# Altium schematic sheet M48_CORE.SchDoc
size A4
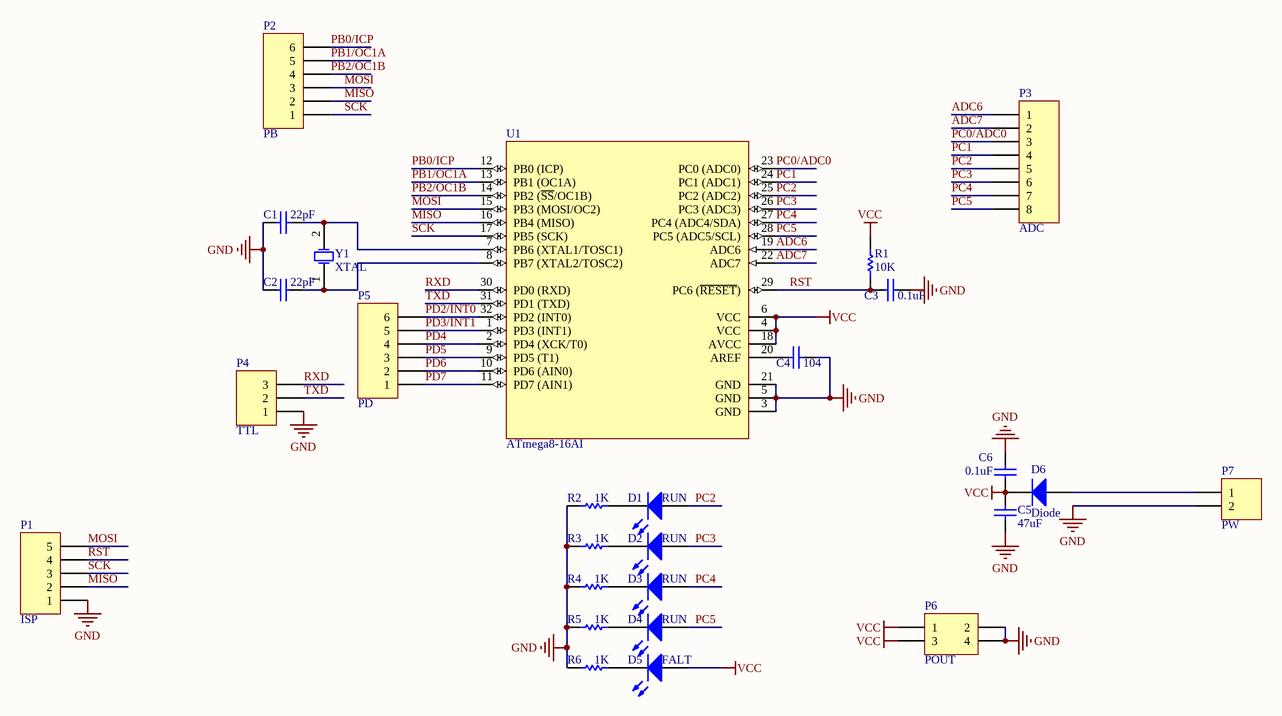
[diagram p0: M48_CORE.SchDoc]

## Parts
C1  value 22pF  [0603]  (hidden comment: Cap)
C2  value 22pF  [0603]  (hidden comment: Cap)
C3  value 0.1uF  [0603]  (hidden comment: Cap)
C4  value 104  [0603]  (hidden comment: Cap)
C5  value 47uF  [3216[1206]]  (hidden comment: Cap)
C6  value 0.1uF  [0603]  (hidden comment: Cap)
D1  RUN  [0603-LED]
D2  RUN  [0603-LED]
D3  RUN  [0603-LED]
D4  RUN  [0603-LED]
D5  FALT  [0603-LED]
D6  Diode  [SMA]
P1  ISP  [HDR1X5]
P2  PB  [HDR1X6]
P3  ADC  [HDR1X8]
P4  TTL  [HDR1X3]
P5  PD  [HDR1X6]
P6  POUT  [HDR2X2]
P7  PW  [XH2.54-2P]
R1  value 10K  [0603]  (hidden comment: Res1)
R2  value 1K  [0603]  (hidden comment: Res1)
R3  value 1K  [0603]  (hidden comment: Res1)
R4  value 1K  [0603]  (hidden comment: Res1)
R5  value 1K  [0603]  (hidden comment: Res1)
R6  value 1K  [0603]  (hidden comment: Res1)
U1  ATmega8-16AI  [32A_N]
Y1  XTAL  [XT5032]

## Nets
GND: C1.2 C2.2 C3.2 C4.2 C5.1 C6.1 P1.1 P4.1 P6.2 P6.4 P7.2 R2.2 R3.2 R4.2 R5.2 R6.2 U1.3(GND) U1.5(GND) U1.21(GND)
VCC: C5.2 C6.2 D5.1(A) D6.2(K) P6.1 P6.3 R1.2 U1.4(VCC) U1.6(VCC) U1.18(AVCC)
ADC6: P3.1 U1.19(ADC6)
ADC7: P3.2 U1.22(ADC7)
MISO: P1.2 P2.2 U1.16(PB4_(MISO))
MOSI: P1.5 P2.3 U1.15(PB3_(MOSI/OC2))
PB0/ICP: P2.6 U1.12(PB0_(ICP))
PB1/OC1A: P2.5 U1.13(PB1_(OC1A))
PB2/OC1B: P2.4 U1.14(PB2_(~{SS}/OC1B))
PC0/ADC0: P3.3 U1.23(PC0_(ADC0))
PC1: P3.4 U1.24(PC1_(ADC1))
PC2: D1.1(A) P3.5 U1.25(PC2_(ADC2))
PC3: D2.1(A) P3.6 U1.26(PC3_(ADC3))
PC4: D3.1(A) P3.7 U1.27(PC4_(ADC4/SDA))
PC5: D4.1(A) P3.8 U1.28(PC5_(ADC5/SCL))
PD2/INT0: P5.6 U1.32(PD2_(INT0))
PD3/INT1: P5.5 U1.1(PD3_(INT1))
PD4: P5.4 U1.2(PD4_(XCK/T0))
PD5: P5.3 U1.9(PD5_(T1))
PD6: P5.2 U1.10(PD6_(AIN0))
PD7: P5.1 U1.11(PD7_(AIN1))
RST: C3.1 P1.4 R1.1 U1.29(PC6_(~{RESET}))
RXD: P4.3 U1.30(PD0_(RXD))
SCK: P1.3 P2.1 U1.17(PB5_(SCK))
TXD: P4.2 U1.31(PD1_(TXD))
NetC1_1: C1.1 U1.7(PB6_(XTAL1/TOSC1)) Y1.2(OSC2)
NetC2_1: C2.1 U1.8(PB7_(XTAL2/TOSC2)) Y1.1(OSC1)
NetC4_1: C4.1 U1.20(AREF)
NetD1_2: D1.2(K) R2.1
NetD2_2: D2.2(K) R3.1
NetD3_2: D3.2(K) R4.1
NetD4_2: D4.2(K) R5.1
NetD5_2: D5.2(K) R6.1
NetD6_1: D6.1(A) P7.1

## Library data of the parts
C1-C6 = Cap: Capacitor; Published: 8-Jun-2000; LatestRevisionDate: 17-Jul-2002; LatestRevisionNote: Re-released for DXP Platform.; PackageReference: RAD-0.3; Publisher: Altium Limited
D1-D5 = LED2: Typical RED, GREEN, YELLOW, AMBER GaAs LED; Published: 8-Jun-2000; LatestRevisionDate: 17-Jul-2002; LatestRevisionNote: Re-released for DXP Platform.; PackageDocument: Feb-2002; PackageReference: 3.2X1.6X1.1; Publisher: Altium Limited
D6 = Diode: Default Diode; Published: 8-Jun-2000; LatestRevisionDate: 17-Jul-2002; LatestRevisionNote: Re-released for DXP Platform.; PackageDocument: Sep-1996; PackageReference: SMC; Publisher: Altium Limited; Code_JEDEC: DO-214-AB
P1 = Header 5: Header, 5-Pin; LatestRevisionDate: 17-Jul-2002; LatestRevisionNote: Re-released for DXP Platform.; Publisher: Altium Limited
P2 P5 = Header 6: Header, 6-Pin; LatestRevisionDate: 17-Jul-2002; LatestRevisionNote: Re-released for DXP Platform.; Publisher: Altium Limited
P3 = Header 8: Header, 8-Pin; LatestRevisionDate: 17-Jul-2002; LatestRevisionNote: Re-released for DXP Platform.; Publisher: Altium Limited
P4 = Header 3: Header, 3-Pin; LatestRevisionDate: 17-Jul-2002; LatestRevisionNote: Re-released for DXP Platform.; Publisher: Altium Limited
P6 = Header 2X2H: Header, 2-Pin, Dual row, Right Angle; LatestRevisionDate: 17-Jul-2002; LatestRevisionNote: Re-released for DXP Platform.; Publisher: Altium Limited
P7 = Header 2: Header, 2-Pin; LatestRevisionDate: 17-Jul-2002; LatestRevisionNote: Re-released for DXP Platform.; Publisher: Altium Limited
R1-R6 = Res1: Resistor; Published: 8-Jun-2000; LatestRevisionDate: 17-Jul-2002; LatestRevisionNote: Re-released for DXP Platform.; PackageReference: AXIAL-0.3; Publisher: Altium Limited
U1 = ATmega8-16AI: 8-Bit AVR Microcontroller with 8K Bytes of In-System Programmable Flash Memory; Published: 17-Sep-2003; LatestRevisionDate: 13-Apr-2006; LatestRevisionNote: IPC-7351 Footprint Added.; DatasheetVersion: 2486H-AVR-09/02; PackageVersion: revB, Oct-2001; PackageReference: 32A; Publisher: Altium Limited; PackageDescription: 32-Pin Thin Quad Flat Pack 0.8 mm Pitch; Code_JEDEC: MS-026-ABA; ComponentLink1Description: Manufacturer Link; ComponentLink1URL: http://www.atmel.com; ComponentLink2Description: Datasheet; ComponentLink2URL: http://www.atmel.com/dyn/resources/prod_documents/doc2486.pdf
Y1 = XTAL: Crystal Oscillator; Published: 8-Jun-2000; LatestRevisionDate: 17-Jul-2002; LatestRevisionNote: Re-released for DXP Platform.; PackageReference: R38; Publisher: Altium Limited